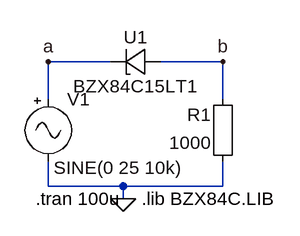
[diagram p0: schematic clipper_series.asc]
clipper_series.asc, the LTspice schematic file:
Version 4
SHEET 1 880 680
WIRE 32 176 -48 176
WIRE 176 176 96 176
WIRE -48 224 -48 176
WIRE 176 224 176 176
WIRE -48 336 -48 304
WIRE 48 336 -48 336
WIRE 176 336 176 304
WIRE 176 336 48 336
WIRE 48 352 48 336
FLAG -48 176 a
FLAG 48 352 0
FLAG 176 176 b
SYMBOL Misc\\EuropeanResistor 192 320 R180
WINDOW 0 31 76 Left 2
WINDOW 3 31 40 Left 2
SYMATTR InstName R1
SYMATTR Value 1000
SYMBOL zener-macro-model 96 160 R90
WINDOW 0 0 32 VBottom 2
WINDOW 3 32 32 VTop 2
SYMATTR InstName U1
SYMATTR Value BZX84C15LT1
SYMBOL Misc\\signal -48 208 R0
WINDOW 3 7 104 Left 2
SYMATTR InstName V1
SYMATTR Value SINE(0 25 10k)
TEXT -64 352 Left 2 !.tran 100u
TEXT 72 352 Left 2 !.lib BZX84C.LIB

The netlist it stands for:
* clipper_series.asc
R1 0 b 1000
XU1 b a BZX84C15LT1  ; pins + -
V1 a 0 SINE(0 25 10k)
.tran 100u
.lib BZX84C.LIB
.backanno
.end